# EAGLE design IoTSensorBoardREV2 (EAGLE 9.0.0)
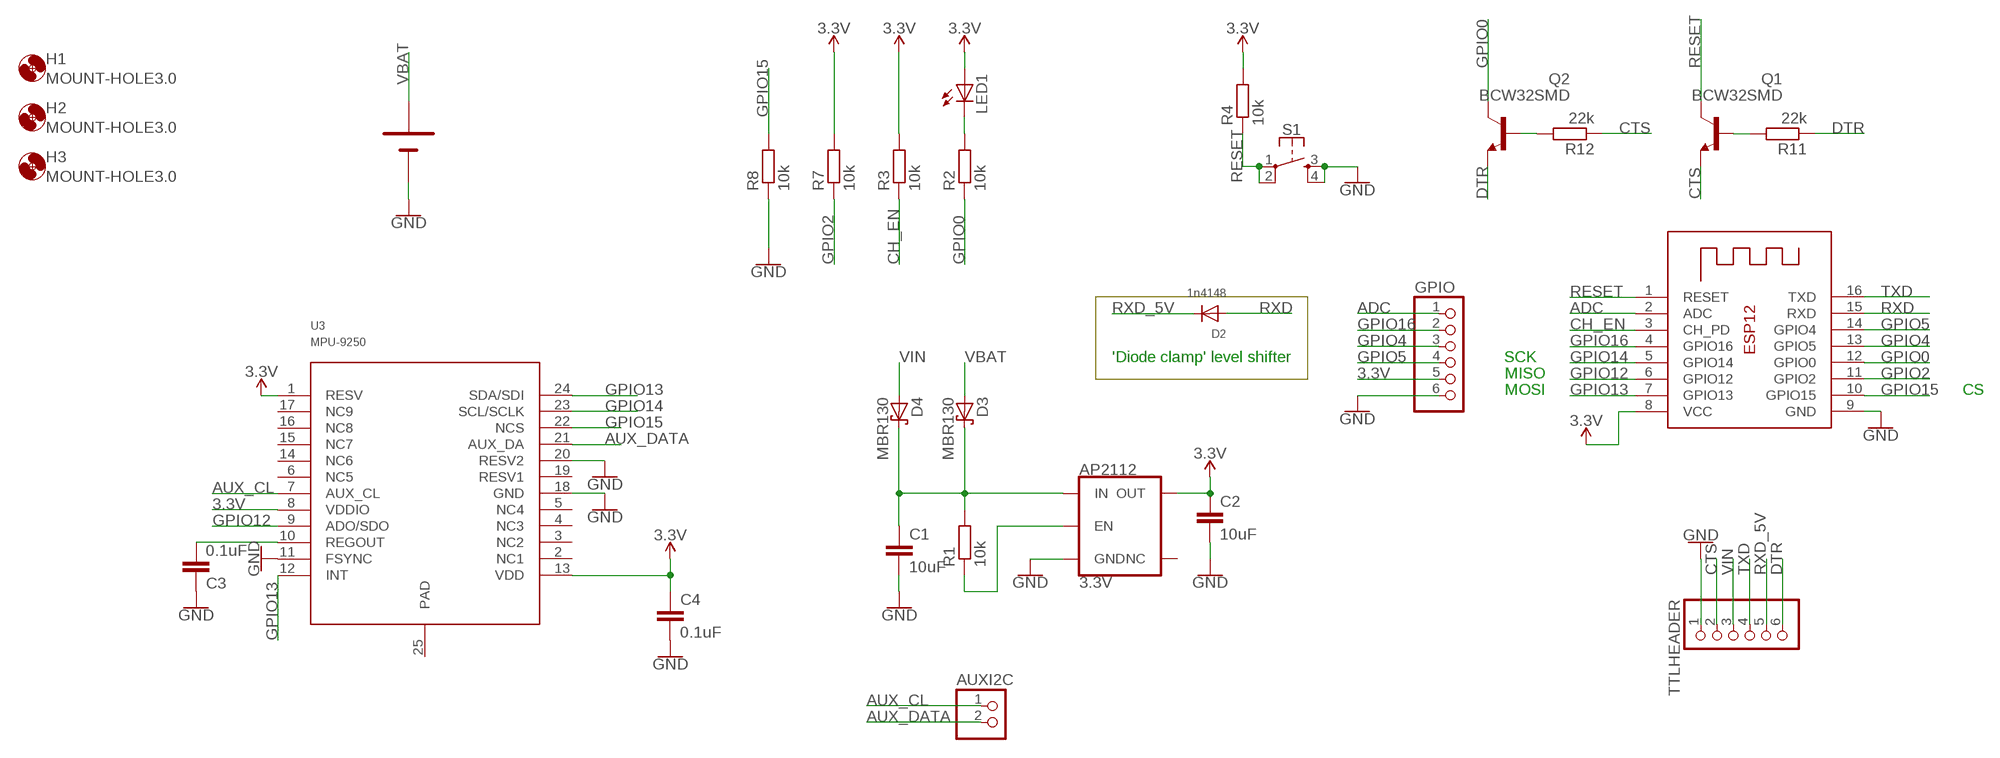
[diagram p0: schematic, sheet 1]

## Parts
AP2112  3.3V  V_REG_AP2112K-3.3V  [SOT23-5]
AUXI2C  PINHD-1X2  [1X02]
C1  10uF  C-EUC0805  [C0805]
C2  10uF  C-EUC0805  [C0805]
C3  0.1uF  C-EUC0805  [C0805]
C4  0.1uF  C-EUC0805  [C0805]
D2  1n4148  DIODESMA  [SMADIODE]
D3  MBR130  MBRS130LT3  [SMB]
D4  MBR130  MBRS130LT3  [SMB]
ESP-12  ESP-12  [ESP-12]
GPIO  PINHD-1X6  [1X06]
H1  MOUNT-HOLE3.0  [3,0]
H2  MOUNT-HOLE3.0  [3,0]
H3  MOUNT-HOLE3.0  [3,0]
LED1  LEDCHIP-LED0805  [CHIP-LED0805]
Q1  BCW32SMD  [SOT23-BEC]
Q2  BCW32SMD  [SOT23-BEC]
R1  10k  R-EU_R0805  [R0805]
R2  10k  R-EU_R0805  [R0805]
R3  10k  R-EU_R0805  [R0805]
R4  10k  R-EU_R0805  [R0805]
R7  10k  R-EU_R0805  [R0805]
R8  10k  R-EU_R0805  [R0805]
R11  22k  R-EU_R0805  [R0805]
R12  22k  R-EU_R0805  [R0805]
S1  MOMENTARY-SWITCH-SPST-2-SMD-5.2MM  [TACTILE_SWITCH_SMD_5.2MM]
TTLHEADER  PINHD-1X6  [1X06]
U3  MPU-9250  [LEAD-QFN24]
U$1  SMTU_2450N  [SMTU_2450N]

## Nets
3.3V: AP2112.5(OUT) C2.1 C4.1 ESP-12.8(VCC) GPIO.5 LED1.A R3.2 R4.2 R7.2 U3.1(RESV) U3.8(VDDIO) U3.13(VDD)
ADC: ESP-12.2(ADC) GPIO.1
AUX_CL: AUXI2C.1 U3.7(AUX_CL)
AUX_DATA: AUXI2C.2 U3.21(AUX_DA)
CH_EN: ESP-12.3(CH_PD) R3.1
CTS: Q1.E R12.1 TTLHEADER.2
DTR: Q2.E R11.1 TTLHEADER.6
GND: AP2112.2(GND) C1.2 C2.2 C3.1 C4.2 ESP-12.9(GND) GPIO.6 R8.1 S1.3 S1.4 TTLHEADER.1 U3.11(FSYNC) U3.18(GND) U3.20(RESV2) U$1.P$1(P$1N)
GPIO0: ESP-12.12(GPIO0) Q2.C R2.1
GPIO2: ESP-12.11(GPIO2) R7.1
GPIO4: ESP-12.13(GPIO5) GPIO.3
GPIO5: ESP-12.14(GPIO4) GPIO.4
GPIO12: ESP-12.6(GPIO12) U3.9(ADO/SDO)
GPIO13: ESP-12.7(GPIO13) U3.12(INT) U3.24(SDA/SDI)
GPIO14: ESP-12.5(GPIO14) U3.23(SCL/SCLK)
GPIO15: ESP-12.10(GPIO15) R8.2 U3.22(NCS)
GPIO16: ESP-12.4(GPIO16) GPIO.2
N$1: AP2112.3(EN) R1.1
N$2: AP2112.1(IN) C1.1 D3.C D4.C R1.2
N$3: LED1.C R2.2
N$5: C3.2 U3.10(REGOUT)
N$7: Q2.B R12.2
N$8: Q1.B R11.2
RESET: ESP-12.1(RESET) Q1.C R4.1 S1.1 S1.2
RXD: D2.A ESP-12.15(RXD)
RXD_5V: D2.C TTLHEADER.5
TXD: ESP-12.16(TXD) TTLHEADER.4
VBAT: D3.A U$1.P$2(P$2P)
VIN: D4.A TTLHEADER.3
Unconnected: AP2112.4(NC) U3.2(NC1) U3.3(NC2) U3.4(NC3) U3.5(NC4) U3.6(NC5) U3.14(NC6) U3.15(NC7) U3.16(NC8) U3.17(NC9) U3.19(RESV1) U3.25(PAD)

## Notes on the sheet
- 'Diode clamp' level shifter | SCK
- MISO
- MOSI | CS

## Library data of the parts
AP2112 = SparkFun-IC-Power:V_REG_AP2112: AP2112 - 600mA CMOS LDO Regulator w/ Enable The AP2112 is CMOS process low dropout linear regulator with enable function, the regulator delivers a guaranteed 600mA (min.) continuous load current. Features Output Voltage Accuracy: ±1.5% Output Current: 600mA (Min.) Foldback Short Current Protection: 50mA Enable Function to Turn ON/OFF VOUT Low Dropout Voltage (3.3V): 250mV (Typ.) @IOUT=600mA Excellent Load Regulation: 0.2%/A (Typ.) Excellent Line Regulation: 0.02%/V (Typ.) Low Quiescent Current: 55μA (Typ.) Low Standby Current: 0.01μA (Typ.) Low Output Noise: 50μVRMS PSRR: 100Hz -65dB, 1kHz -65dB OTSD Protection Stable with 1.0μF Flexible Cap: Ceramic, Tantalum and Aluminum Electrolytic Operation Temperature Range: -40°C to 85°C ESD: MM 400V, HBM 4000V; PROD_ID: VREG-12457
AUXI2C = pinhead:PINHD-1X2: PIN HEADER
C1-C4 = rcl:C-EU: CAPACITOR, European symbol; SPICEPREFIX: C
D2 = adafruit:DIODE: Diode SMADIODE - SMA Surface Mount Package 20V 1A Schottky Diode Digikey: 641-1014-6-ND DO-1N4148 - Through Hole Small Current Diode SOD-123 20V 1 A (.5mV Vf) Schottky Diode - Digikey: MBRX120TPMSCT-ND SOD-323 10V 570mA (.38mV Vf, 3ns) Schottky Diode - Digikey: ZLLS410CT-ND SOD-523 30V 30mA Schottky Diode (RB751S-40TE61) - Digikey: RB751S-40TE61CT-ND SOT23-R/W - SOT23 Package (R = Solder Paste/Reflow Ovens, W = Hand-Soldering) BAT54Film 40V 300mA - Digikey: 497-7162-1-ND
D3 D4 = diode:MBRS130LT3: Schottky Power Rectifier Source: http://www.onsemi.com/pub/Collateral/MBRS130LT3-D.PDF
ESP-12 = adafruit:ESP-12
GPIO TTLHEADER = pinhead:PINHD-1X6: PIN HEADER
H1-H3 = holes:MOUNT-HOLE: MOUNTING HOLE with drill center marker
LED1 = adafruit:LED: LED OSRAM: - CHIPLED LG R971, LG N971, LY N971, LG Q971, LY Q971, LO R971, LY R971 LH N974, LH R974 LS Q976, LO Q976, LY Q976 LO Q996 - Hyper CHIPLED LW Q18S LB Q993, LB Q99A, LB R99A - SideLED LS A670, LO A670, LY A670, LG A670, LP A670 LB A673, LV A673, LT A673, LW A673 LH A674 LY A675 LS A676, LA A676, LO A676, LY A676, LW A676 LS A679, LY A679, LG A679 - Hyper Micro SIDELED® LS Y876, LA Y876, LO Y876, LY Y876 LT Y87S - SmartLED LW L88C, LW L88S LB L89C, LB L89S, LG L890 LS L89K, LO L89K, LY L89K LS L896, LA L896, LO L896, LY L896 - TOPLED LS T670, LO T670, LY T670, LG T670, LP T670 LSG T670, LSP T670, LSY T670, LOP T670, LYG T670 LG T671, LOG T671, LSG T671 LB T673, LV T673, LT T673, LW T673 LH T674 LS T676, LA T676, LO T676, LY T676, LB T676, LH T676, LSB T676, LW T676 LB T67C, LV T67C, LT T67C, LS T67K, LO T67K, LY T67K, LW E67C LS E67B, LA E67B, LO E67B, LY E67B, LB E67C, LV E67C, LT E67C LW T67C LS T679, LY T679, LG T679 LS T770, LO T770, LY T770, LG T770, LP T770 LB T773, LV T773, LT T773, LW T773 LH T774 LS E675, LA E675, LY E675, LS T675 LS T776, LA T776, LO T776, LY T776, LB T776 LHGB T686 LT T68C, LB T68C - Hyper Mini TOPLED® LB M676 - Mini TOPLED Santana® LG M470 LS M47K, LO M47K, LY M47K Source: http://www.osram.convergy.de/
Q1 Q2 = transistor-npn:BCW32*: NPN Transistor
R1-R4 R7 R8 R11 R12 = rcl:R-EU_: RESISTOR, European symbol; SPICEPREFIX: R
S1 = SparkFun-Switches:MOMENTARY-SWITCH-SPST-2: Momentary Switch (Pushbutton) - SPST - Two Circuits Normally-open (NO) SPST momentary switches (buttons, pushbuttons). Schematic symbol includes two switch circuits. Variants SMD-4.6MMX2.8MM - 4.60mm x 2.80mm Tactile Momentary Button Switch - Used on SparkFun SAMD21 Mini Breakout <https://www.sparkfun.com/products/13664> SMD-5.2MM - Mini Pushbutton Switch - SMD <https://www.sparkfun.com/products/8720> - Used on Arduino Pro Mini <https://www.sparkfun.com/products/11114>; PROD_ID: SWCH-08247; SF_SKU: COM-08720
U3 = invensense:MPU-9250
U$1 = CustomIoTLibrary:SMTU_2450N

## Board
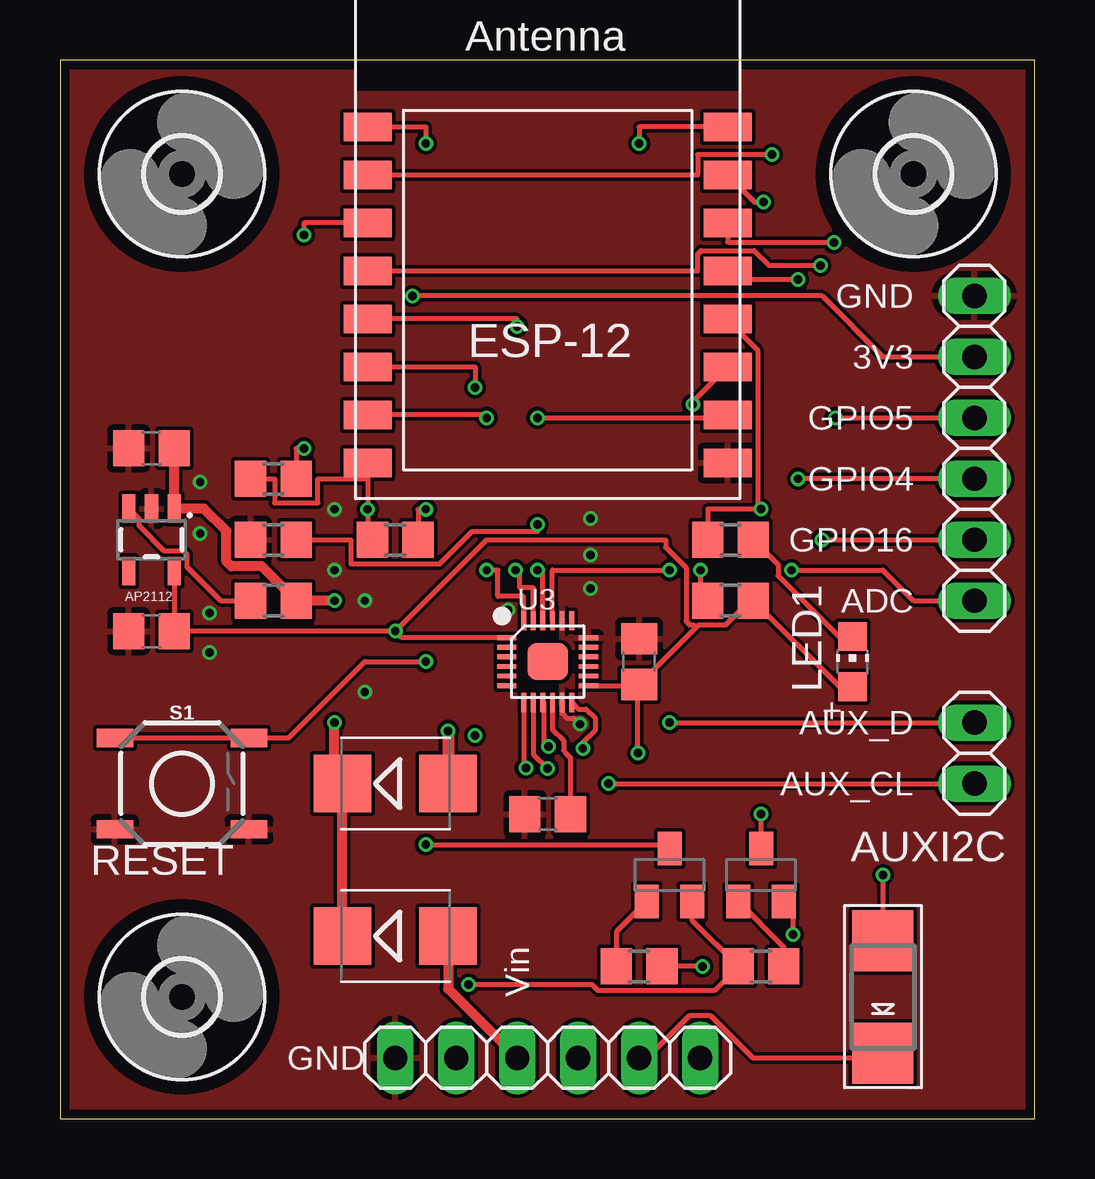
[diagram p1: board, top side]
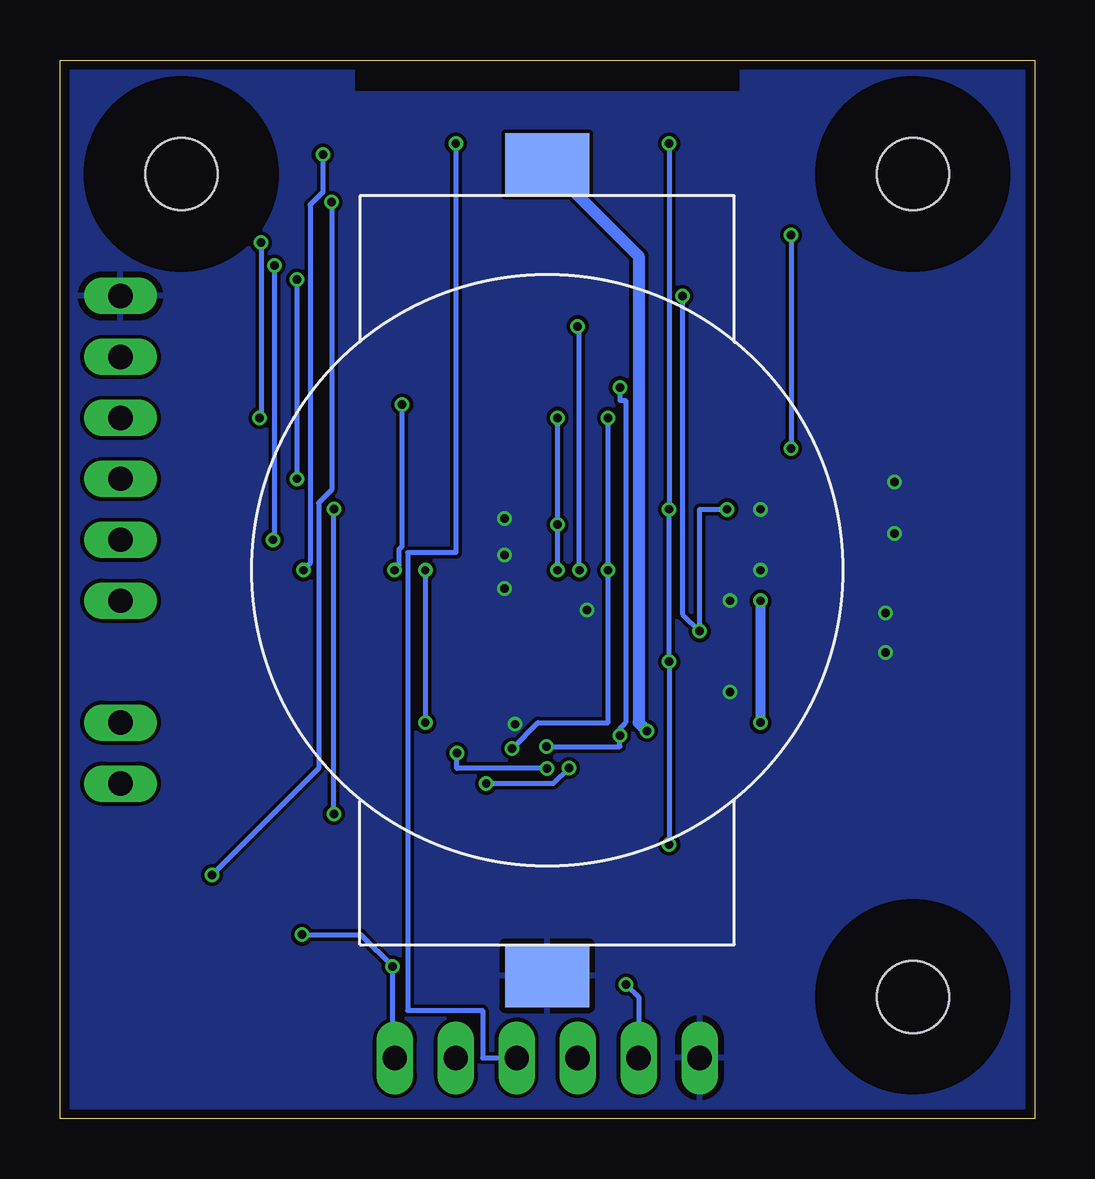
[diagram p2: board, bottom side, seen from below]

Size 40.62 x 44.12 mm. Coordinates in mm from the lower left corner, seen from the top.
Outline: 0,0 40.62,0 40.62,44.12 0,44.12 0,0
Copper layers (1*16): Top 0.035559375mm / dielectric 1.6mm / Bottom 0.035559375mm
Design rules "oshpark-2layer": minimum track width 6mil, minimum drill 10mil, track to track 6mil, track to pad 6mil, pad to pad 6mil, via to via 6mil, smd to smd 6mil, copper to edge 15mil, drill to drill 6mil, minimum pad ring 5mil, minimum via ring 5mil, stop-mask expansion 2.5mil, vias tented up to drill 0mil, thermal gap 10mil

### Footprints (pad centres in the part's own frame; a part is rotated, then mirrored left to right if it is on the bottom)
SOT23-5 = smd 0.55 x 1.2: 1 -0.95,-1.3; 2 0,-1.3; 3 0.95,-1.3; 4 0.95,1.3; 5 -0.95,1.3
1X02 = drill 1.016 long: 1 -1.27,0; 2 1.27,0
C0805 = smd 1.3 x 1.5: 1 -0.95,0; 2 0.95,0
SMADIODE = smd 2.54 x 2.54: A 2.349,0; C -2.349,0
SMB = smd 2.4 x 2.4: A 2.2,0; C -2.2,0
ESP-12 = smd 2 x 1.2: 1 -7.5,4.5; 2 -7.5,2.5; 3 -7.5,0.5; 4 -7.5,-1.5; 5 -7.5,-3.5; 6 -7.5,-5.5; 7 -7.5,-7.5; 8 -7.5,-9.5; 9 7.5,-9.5; 10 7.5,-7.5; 11 7.5,-5.5; 12 7.5,-3.5; 13 7.5,-1.5; 14 7.5,0.5; 15 7.5,2.5; 16 7.5,4.5
1X06 = drill 1.016 long: 1 -6.35,0; 2 -3.81,0; 3 -1.27,0; 4 1.27,0; 5 3.81,0; 6 6.35,0
3,0 = hole 3: 0,0
CHIP-LED0805 = smd 1.2 x 1.2: A 0,-1.05; C 0,1.05
SOT23-BEC = smd 1 x 1.4: B -0.95,-1.1; C 0,1.1; E 0.95,-1.1
R0805 = smd 1.3 x 1.5: 1 -0.95,0; 2 0.95,0
TACTILE_SWITCH_SMD_5.2MM = smd 1.524 x 0.762: 1 -2.794,1.905; 2 2.794,1.905; 3 -2.794,-1.905; 4 2.794,-1.905
LEAD-QFN24 = smd 0.8 x 0.2: 1 -1.7,1; 2 -1.7,0.6; 3 -1.7,0.2; 4 -1.7,-0.2; 5 -1.7,-0.6; 6 -1.7,-1; 13 1.7,-1; 14 1.7,-0.6; 15 1.7,-0.2; 16 1.7,0.2; 17 1.7,0.6; 18 1.7,1 | smd 0.2 x 0.8: 7 -1,-1.7; 8 -0.6,-1.7; 9 -0.2,-1.7; 10 0.2,-1.7; 11 0.6,-1.7; 12 1,-1.7; 19 1,1.7; 20 0.6,1.7; 21 0.2,1.7; 22 -0.2,1.7; 23 -0.6,1.7; 24 -1,1.7 | smd 1.7 x 1.54: 25 0,0
SMTU_2450N = smd 2.6 x 3.5: P$1 -16.9,0; P$2 16.9,0

### Placement (x,y rotation side)
AP2112  3.81,24.13 180 top
AUXI2C  38.1,15.24 90 top
C1  3.81,27.94 180 top
C2  3.81,20.32 180 top
C3  20.32,12.7 0 top
C4  24.13,19.05 90 top
D2  34.29,5.08 90 top
D3  13.97,13.97 0 top
D4  13.97,7.62 0 top
ESP-12  20.32,36.83 0 top
GPIO  38.1,27.94 90 top
H1  5.08,5.08 0 top
H2  35.56,39.37 0 top
H3  5.08,39.37 0 top
LED1  33.02,19.05 0 top
Q1  25.4,10.16 0 top
Q2  29.21,10.16 0 top
R1  8.89,21.59 0 top
R2  27.94,24.13 0 top
R3  8.89,26.67 180 top
R4  13.97,24.13 180 top
R7  27.94,21.59 0 top
R8  8.89,24.13 0 top
R11  24.13,6.35 180 top
R12  29.21,6.35 0 top
S1  5.08,13.97 0 top
TTLHEADER  20.32,2.54 0 top
U3  20.32,19.05 0 top
U$1  20.32,22.86 90 bottom

### Tracks (layer width: path | path; a pad name or v marks a point on that pad's centre or on a via)
3.3V  (via drill 0.35)
  Top 0.2: U3.13 24.08,18.05 | 24.08,18.05 C4.1 26.51,20.48 | AP2112.5 C2.1 v13.97,20.32 | ESP-12.8 12.82,26.67 | 12.82,26.67 v12.82,25.4 12.82,24.33 R4.2 | U3.1 14.24,20.05 v13.97,20.32 | v13.97,20.32 17.78,24.13 25.23,24.13 25.23,23.81 26.09,22.96 26.09,20.73 26.23,20.59 26.4,20.59 26.51,20.48 | 26.51,20.48 26.62,20.59 27.75,20.59 28.75,21.59 R7.2 32.48,18 LED1.A | v24.08,15.24 24.08,18.05 | R3.2 8.94,26.67 8.94,25.67 10.74,25.67 10.74,26.67 12.82,26.67 | U3.8 19.72,15.2 v20.32,14.6 | v14.69,34.29 31.75,34.29 34.29,31.75 GPIO.5
  Bottom 0.2: v12.82,25.4 13.97,25.4 v13.97,20.32 14.69,21.04 v14.69,34.29 | v20.32,14.6 24.08,14.6 v24.08,15.24
ADC  (via drill 0.35)
  Top 0.2: ESP-12.2 26.57,39.33 26.57,40.18 v29.67,40.18 | v30.48,22.86 34.29,22.86 35.56,21.59 GPIO.1
  Bottom 0.2: v29.67,40.18 29.67,38.62 30.19,38.09 30.19,23.15 v30.48,22.86
AUX_CL  (via drill 0.35)
  Top 0.2: U3.7 19.32,14.62 v19.41,14.62 | v22.86,13.97 AUXI2C.1
  Bottom 0.2: v19.41,14.62 20.06,13.97 v22.86,13.97
AUX_DATA  (via drill 0.35)
  Top 0.2: U3.21 20.52,22.86 v25.4,22.86 | v25.4,16.51 AUXI2C.2
  Bottom 0.2: v25.4,22.86 v25.4,16.51
CH_EN  (via drill 0.35)
  Top 0.2: ESP-12.3 10.16,37.33 v10.16,36.83 | v10.16,27.94 9.84,27.94 R3.1
  Bottom 0.2: v10.16,36.83 v10.16,27.94
CTS  (via drill 0.35)
  Top 0.2: Q1.E 26.35,8.26 R12.1 27.26,5.35 22.43,5.35 22.17,5.6 v17.03,5.6
  Bottom 0.2: v17.03,5.6 16.51,5.08 TTLHEADER.2
DTR  (via drill 0.35)
  Top 0.2: Q2.E 30.54,8.68 v30.54,7.68 | v26.76,6.35 R11.1
  Bottom 0.2: v30.54,7.68 28.09,7.68 v26.76,6.35 26.76,2.63 TTLHEADER.6
GND  (via drill 0.35)
  Top 0.2: U3.11 20.92,16.89 21.11,16.7 21.4,16.7 v21.66,16.44
  other vias: 11.43,25.4 11.43,22.86 12.7,21.59 12.7,17.78 22.1,25.02 22.1,23.5 22.1,22.1 18.67,21.21 5.84,26.54 5.84,24.38 6.22,21.08 6.22,19.43
  pour Bottom: -1.27,44.45 40.64,44.45 40.64,-1.27 -1.27,-1.27
  pour Top: 0,44.45 40.64,44.45 40.64,0 0,0
GPIO0  (via drill 0.35)
  Top 0.2: Q2.C v29.21,12.7 | R2.1 26.99,25.41 v29.21,25.41 29.07,25.55 29.07,32.03 27.82,33.29 ESP-12.12
  Bottom 0.2: v29.21,12.7 v29.21,25.41
GPIO2  (via drill 0.35)
  Top 0.2: 26.76,21.82 R7.1 26.69,21.89 v26.69,22.86 | 27.52,31.33 ESP-12.11 26.37,29.88 v26.37,29.76
  Bottom 0.2: v26.69,22.86 26.48,23.06 26.48,23.74 26.37,23.86 v26.37,29.76
GPIO4  (via drill 0.35)
  Top 0.2: ESP-12.13 28.72,35.33 28.72,34.98 v30.75,34.98 | GPIO.3 v30.75,26.67
  Bottom 0.2: v30.75,34.98 v30.75,26.67
GPIO5  (via drill 0.35)
  Top 0.2: ESP-12.14 27.82,36.53 32.27,36.53 | 36.08,29.21 GPIO.4 v32.3,29.21 | 32.27,36.53 | 32.27,36.53 v32.24,36.51
  Bottom 0.2: v32.24,36.51 32.24,29.27 v32.3,29.21
GPIO12  (via drill 0.35)
  Top 0.2: ESP-12.6 17.3,31.33 v17.3,30.48 | U3.9 20.17,17.35 20.17,15.51 v20.35,15.51
  Bottom 0.2: v17.3,30.48 17.3,29.94 17.05,29.94 17.05,16.51 17.3,16.26 v17.3,15.97 17.3,15.51 v20.35,15.51
GPIO13  (via drill 0.35)
  Top 0.2: 12.82,29.21 ESP-12.7 17.78,29.33 v17.78,29.21 | v17.78,22.86 18.25,22.86 18.25,21.77 19.32,21.77 U3.24 | U3.12 21.6,17.07 21.93,17.07 22.29,16.7 22.29,16.18 21.78,15.67 v21.78,15.43
  Bottom 0.2: v17.78,29.21 v17.78,22.86 17.78,16.51 20.7,16.51 v21.78,15.43
GPIO14  (via drill 0.35)
  Top 0.2: U3.23 19.72,22.13 19.16,22.13 19.16,22.86 v18.98,22.86 | v19.05,33.02 19.05,33.33 ESP-12.5
  Bottom 0.2: v18.98,22.86 18.98,33.02 v19.05,33.02
GPIO15  (via drill 0.35)
  Top 0.2: U3.22 20.12,22.86 v19.89,22.86 | ESP-12.10 27.82,29.21 v19.89,29.21 | R8.2 12.12,24.13 12.12,23.13 15.82,23.13 17.18,24.48 19.89,24.48 v19.89,24.76
  Bottom 0.2: v19.89,22.86 v19.89,24.76 v19.89,29.21
GPIO16  (via drill 0.35)
  Top 0.2: ESP-12.4 26.57,35.33 26.57,36.03 26.71,36.18 28.93,36.18 29.55,35.56 v31.69,35.56 | v31.75,24.13 GPIO.2
  Bottom 0.2: v31.69,35.56 31.69,24.19 v31.75,24.13
N$1
  Top 0.2: R1.1 6.7,21.59 5.29,23 5.29,23.53 5.14,23.68 4.33,23.68 3.28,24.73 3.28,25.01 AP2112.3
N$2  (via drill 0.35)
  Top 0.2: 10,21.43 R1.2
  Top 0.406: D4.C D3.C 11.43,14.31 v11.43,16.51 | C1.1 AP2112.1 6,25.43 6.93,24.5 6.93,23.23 7.14,23.02 8.41,23.02 8.95,22.49 8.95,22.48 R1.2 v11.43,21.59
  Bottom 0.406: v11.43,16.51 v11.43,21.59
N$3
  Top 0.2: R2.2 29.93,23.09 29.93,22.63 32.46,20.1 LED1.C
N$5
  Top 0.2: U3.10 20.52,16.51 20.52,16.24 20.52,16.23 20.98,15.77 20.98,15.34 21.08,15.24 21.27,15.05 C3.2
N$7
  Top 0.2: Q2.B 30.16,7.16 R12.2
N$8
  Top 0.2: Q1.B 23.18,7.79 R11.2
RESET  (via drill 0.35)
  Top 0.2: S1.1 S1.2 9.53,15.88 12.7,19.05 v15.24,19.05 | ESP-12.1 15.24,41.33 v15.24,40.64 | v15.24,25.4 14.92,25.4 R4.1 | v15.24,11.43 25.23,11.43 Q1.C
  Bottom 0.2: v15.24,40.64 v15.24,25.4 v15.24,19.05 v15.24,11.43
RXD  (via drill 0.35)
  Top 0.2: 26.92,38.98 26.92,39.33 ESP-12.15 28.95,38.2 v29.3,38.2 | v34.29,10.16 D2.A
  Bottom 0.2: v29.3,38.2 29.3,26.21 29.84,25.67 29.84,14.61 v34.29,10.16
RXD_5V
  Top 0.2: D2.C 34.1,2.54 28.87,2.54 27.09,4.32 26.25,4.32 24.47,2.54 TTLHEADER.5
TXD  (via drill 0.35)
  Top 0.2: ESP-12.16 24.13,41.33 v24.13,40.64
  Bottom 0.2: TTLHEADER.4 23.01,2.54 23.01,4.52 26.13,4.52 26.13,23.59 24.13,23.59 v24.13,40.64
VBAT  (via drill 0.35)
  Top 0.508: v16.17,16.17 D3.A
  Bottom 0.508: U$1.P$2 16.51,35.95 16.51,16.51 v16.17,16.17
VIN
  Top 0.406: D4.A 16.17,5.42 TTLHEADER.3

### Text on the board
tPlace: GND | 3V3 | GPIO5 | GPIO4 | GPIO16 | ADC | AUX_D | AUX_CL | RESET | Vin | GND